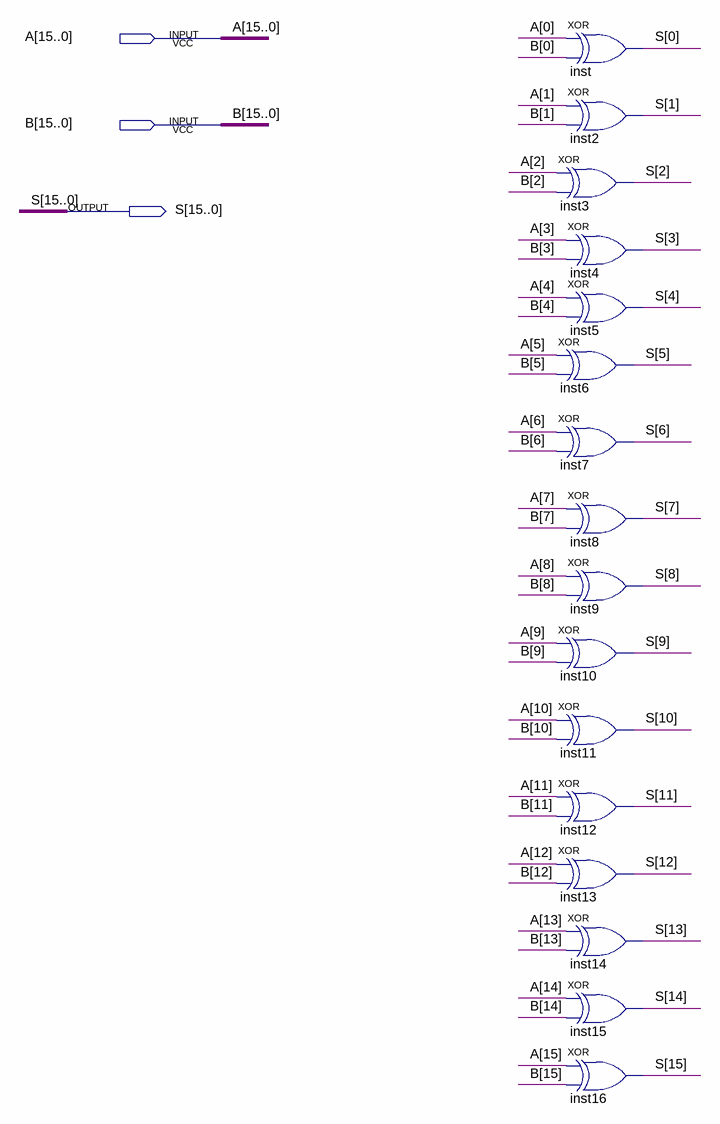
[diagram p0: schematic sheet]
// Quartus schematic XOR16bit.bdf as structural Verilog: 16 symbols, 3 pins
module XOR16bit (
  input  [15:0] A,
  input  [15:0] B,
  output [15:0] S
);

  xor inst3 (S[2], A[2], B[2]);
  xor inst6 (S[5], A[5], B[5]);
  xor inst7 (S[6], A[6], B[6]);
  xor inst10 (S[9], A[9], B[9]);
  xor inst11 (S[10], A[10], B[10]);
  xor inst12 (S[11], A[11], B[11]);
  xor inst13 (S[12], A[12], B[12]);
  xor inst (S[0], A[0], B[0]);
  xor inst2 (S[1], A[1], B[1]);
  xor inst4 (S[3], A[3], B[3]);
  xor inst5 (S[4], A[4], B[4]);
  xor inst8 (S[7], A[7], B[7]);
  xor inst9 (S[8], A[8], B[8]);
  xor inst14 (S[13], A[13], B[13]);
  xor inst15 (S[14], A[14], B[14]);
  xor inst16 (S[15], A[15], B[15]);
endmodule
